# EAGLE design 5v power supply (EAGLE 9.6.2)
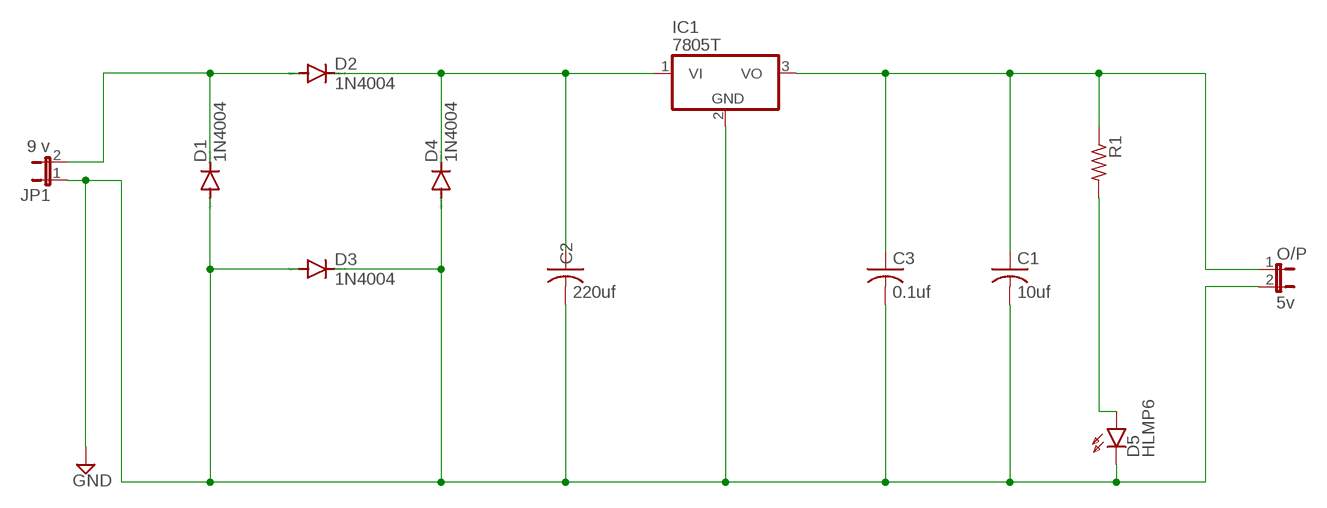
[diagram p0: schematic, sheet 1]

## Parts
C1  10uf  C-US025-024X044  [C025-024X044]
C2  220uf  C-US025-024X044  [C025-024X044]
C3  0.1uf  C-US025-024X044  [C025-024X044]
D1  1N4004  [DO41-10]
D2  1N4004  [DO41-10]
D3  1N4004  [DO41-10]
D4  1N4004  [DO41-10]
D5  HLMP6  [HLMP6]
IC1  7805T  [TO220H]
JP1  9 v  JP1E  [JP1]
O/P  5v  JP1E  [JP1]
R1  R-US_0204/2V  [0204V]

## Nets
GND: C1.2 C2.2 C3.2 D1.A D3.A D3.C D4.A D5.K IC1.2(GND) JP1.1 O/P.2
N$1: D1.C D2.A JP1.2
N$2: C2.1 D2.C D4.C IC1.1(VI)
N$5: C1.1 C3.1 IC1.3(VO) O/P.1 R1.1
N$8: D5.A R1.2

## Library data of the parts
C1-C3 = rcl:C-US: CAPACITOR, American symbol; SPICEPREFIX: C
D1-D4 = diode:1N4004: DIODE general purpose rectifier, 1 A
D5 = display-hp:HLMP6: LED 2mm horizontal; MF: AGILENT TECHNOLOGIES; MPN: HLMP-6500; OC_FARNELL: 1652490; OC_NEWARK: 40K0088
IC1 = linear:78*: Positive VOLTAGE REGULATOR Source: http://cache.national.com/ds/LM/LM78L05.pdf http://www.fairchildsemi.com/ds/LM/LM7805.pdf
JP1 O/P = jumper:JP1E: JUMPER
R1 = rcl:R-US_: RESISTOR, American symbol; SPICEPREFIX: R

## Board
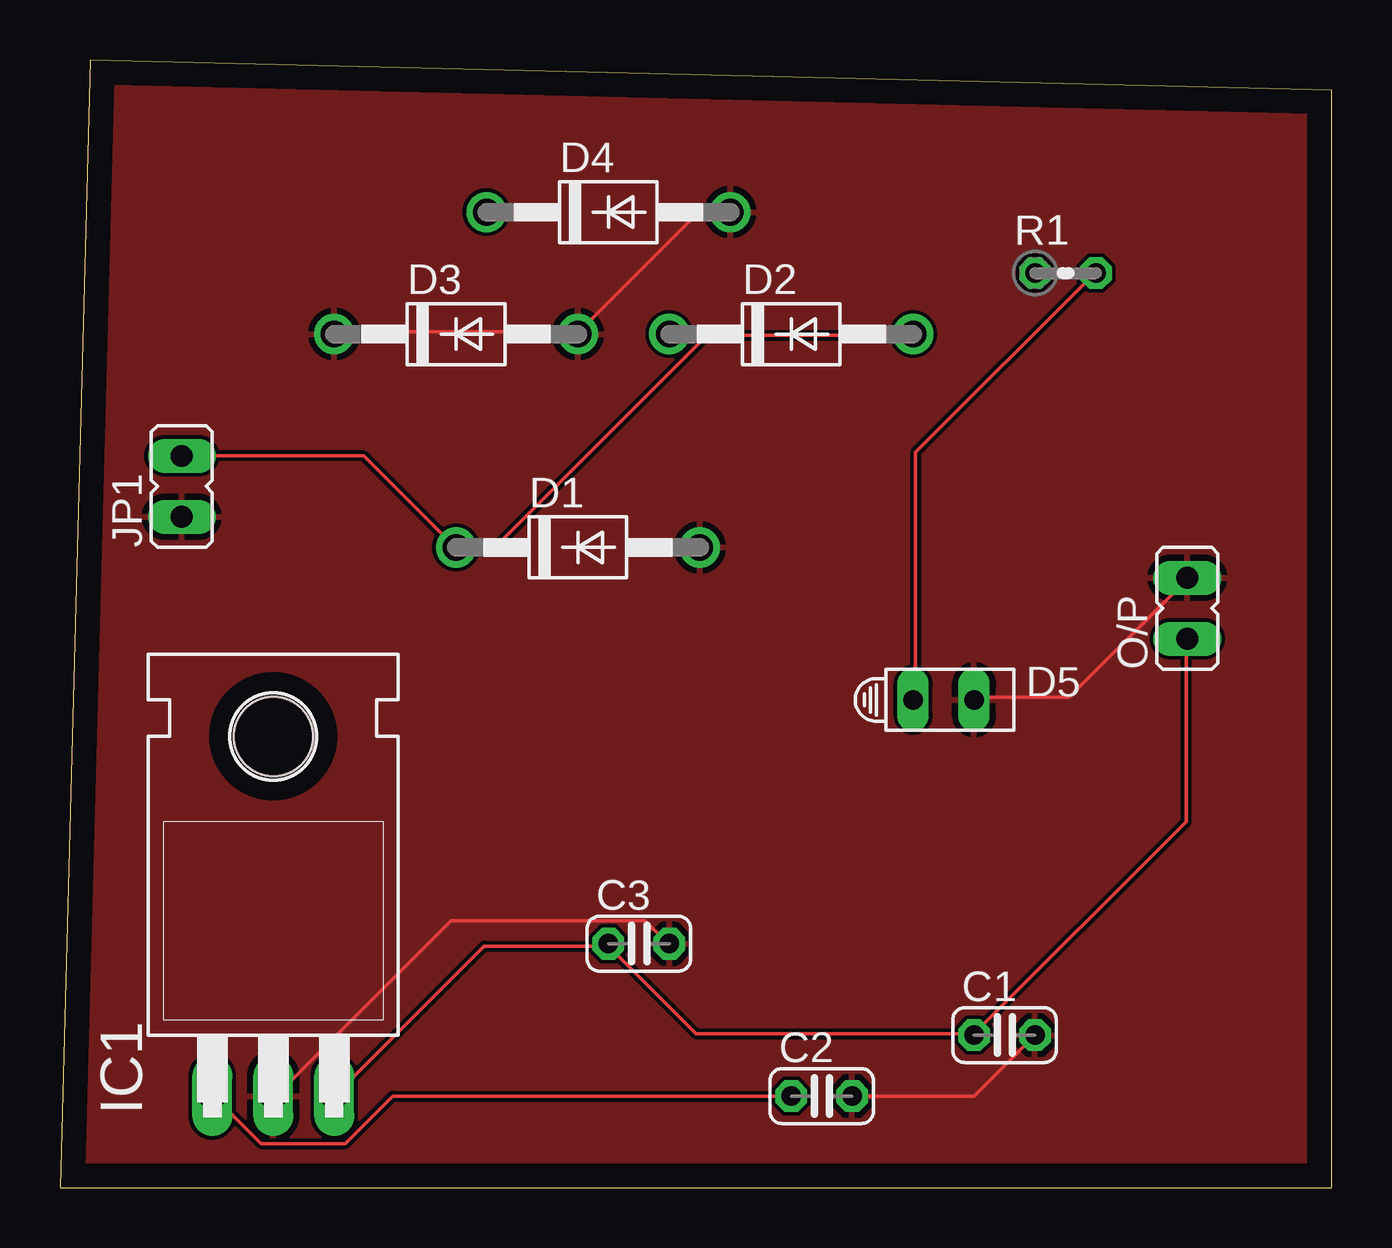
[diagram p1: board, top side]
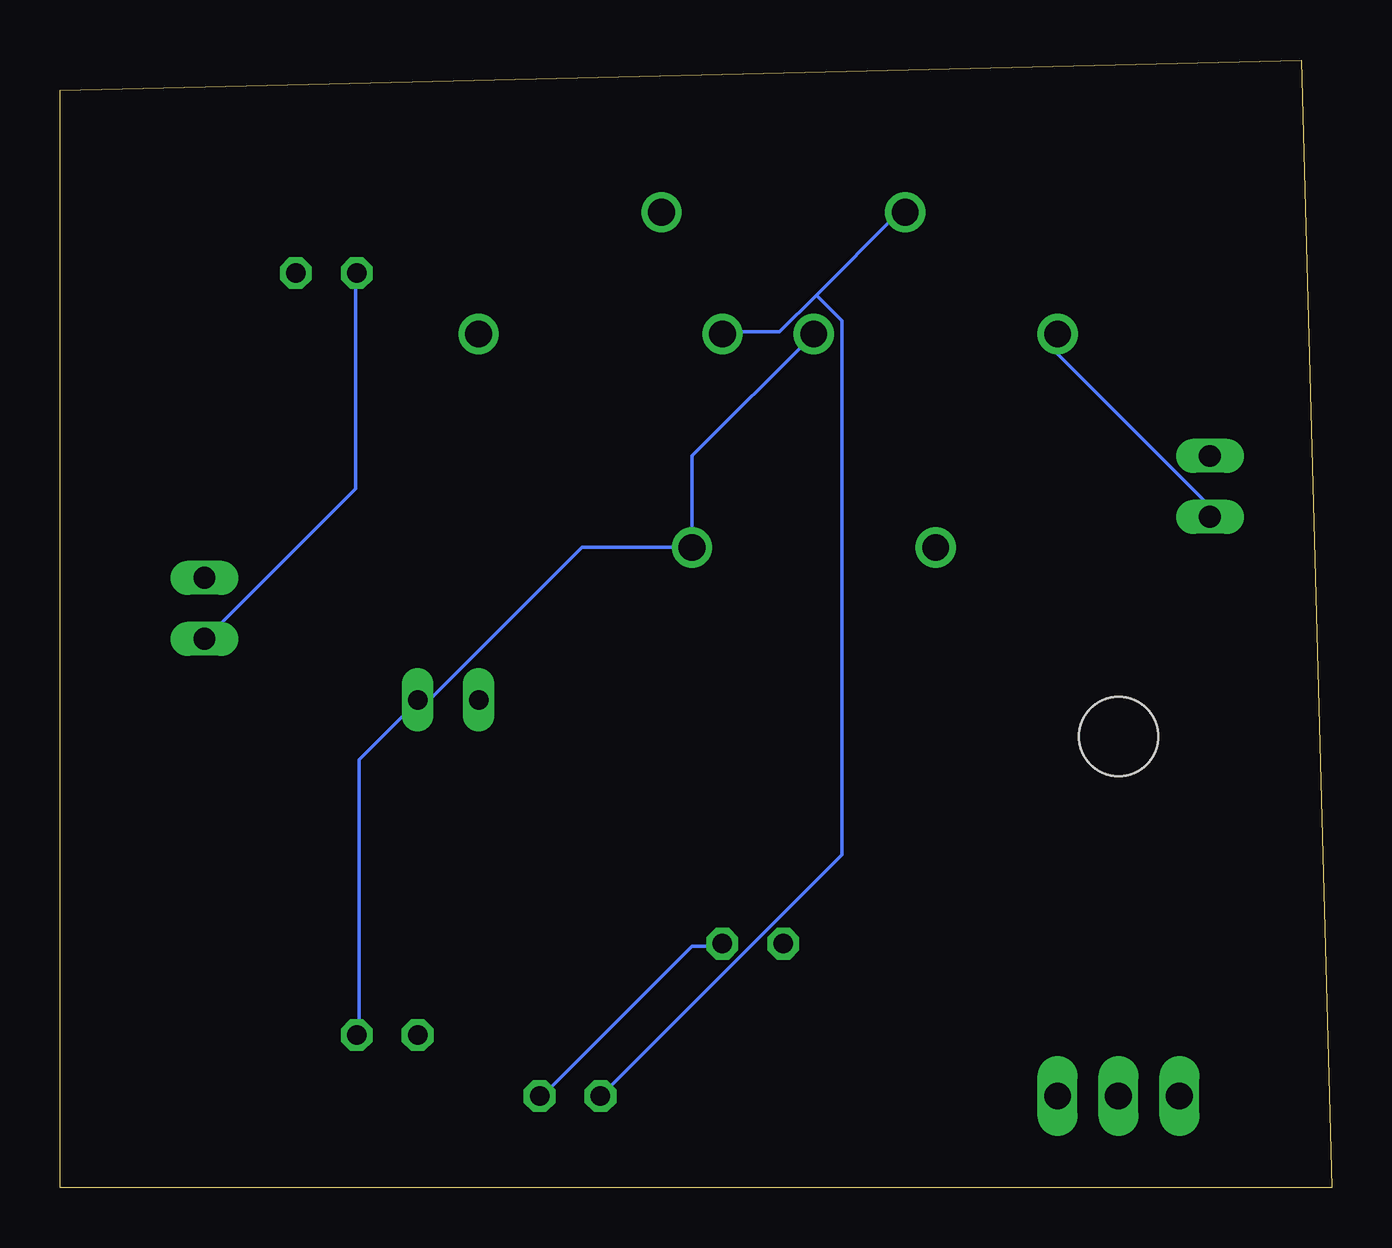
[diagram p2: board, bottom side, seen from below]

Size 53.01 x 46.98 mm. Coordinates in mm from the lower left corner, seen from the top.
Outline: 0,0 53.01,0 53.01,45.71 1.27,46.98 0,0
Copper layers (1*16): Top 0.035mm / dielectric 1.5mm / Bottom 0.035mm
Design rules "default": minimum track width 6mil, minimum drill 0.35mm, track to track 6mil, track to pad 6mil, pad to pad 6mil, via to via 6mil, smd to smd 6mil, copper to edge 40mil, drill to drill 6mil, minimum pad ring 10mil, minimum via ring 8mil, stop-mask expansion 4mil, vias tented up to drill 0mil, thermal gap 10mil

### Footprints (pad centres in the part's own frame; a part is rotated, then mirrored left to right if it is on the bottom)
C025-024X044 = drill 0.813 octagon: 1 -1.27,0; 2 1.27,0
DO41-10 = drill 1.118: A 5.08,0; C -5.08,0
HLMP6 = drill 0.813 long: A -1.27,0; K 1.27,0
TO220H = drill 1.118 long: 1 -2.54,-10.16; 2 0,-10.16; 3 2.54,-10.16 | hole 3.302: 0,4.826
JP1 = drill 0.914 long: 1 0,-1.27; 2 0,1.27
0204V = drill 0.813 octagon: 1 -1.27,0; 2 1.27,0

### Placement (x,y rotation side)
C1  39.37,6.35 0 top
C2  31.75,3.81 0 top
C3  24.13,10.16 0 top
D1  21.59,26.67 0 top
D2  30.48,35.56 0 top
D3  16.51,35.56 0 top
D4  22.86,40.64 0 top
D5  36.83,20.32 0 top
IC1  8.89,13.97 0 top
JP1  5.08,29.21 0 top
O/P  46.99,24.13 0 top
R1  41.91,38.1 0 top

### Tracks (layer width: path | path; a pad name or v marks a point on that pad's centre or on a via)
GND
  Top 0.152: C2.2 38.1,3.81 C1.2 | IC1.2 8.99,3.81 16.31,11.12 24.38,11.12 25.3,10.21 C3.2 | D5.K 38.1,20.42 42.06,20.42 46.94,25.3 O/P.2 | D4.A 27.89,40.54 26.52,40.54 21.64,35.66 D3.A 21.49,35.66 11.43,35.66 D3.C
  Bottom 0.152: C3.2 25.45,10.06 26.67,10.06 32.92,3.81 C2.2 | D3.C 11.43,34.75 5.18,28.5 5.18,28.04 JP1.1 | D3.A 26.67,30.48 D1.A 31.24,26.67 37.49,20.42 38.1,20.42 D5.K 38.1,20.27 40.54,17.83 40.54,6.4 C1.2
  pour Top: -6.35,52.07 58.42,52.07 58.42,1.27 55.88,-1.27 -7.62,-1.27 -7.62,50.8
N$1
  Top 0.152: JP1.2 12.65,30.48 16.46,26.67 D1.C 18.14,26.67 26.98,35.51 35.51,35.51 D2.A
N$2
  Top 0.152: C2.1 13.87,3.81 11.89,1.83 8.38,1.83 6.4,3.81 IC1.1
  Bottom 0.152: 21.49,37.19 18.14,40.54 17.83,40.54 D4.C | 21.49,37.19 23.01,35.66 25.3,35.66 D2.C | 21.49,37.19 20.42,36.12 20.42,13.87 C2.1
N$5
  Top 0.152: 22.86,10.06 17.68,10.06 IC1.3 | 38.1,6.4 26.52,6.4 22.86,10.06 | 22.86,10.06 C3.1 | 38.1,6.4 46.94,15.24 46.94,22.86 O/P.1 | 38.1,6.4 C1.1
  Bottom 0.152: R1.1 40.69,38.1 40.69,29.11 46.94,22.86 O/P.1
N$8
  Top 0.152: D5.A 35.66,20.42 35.66,30.63 43.13,38.1 R1.2